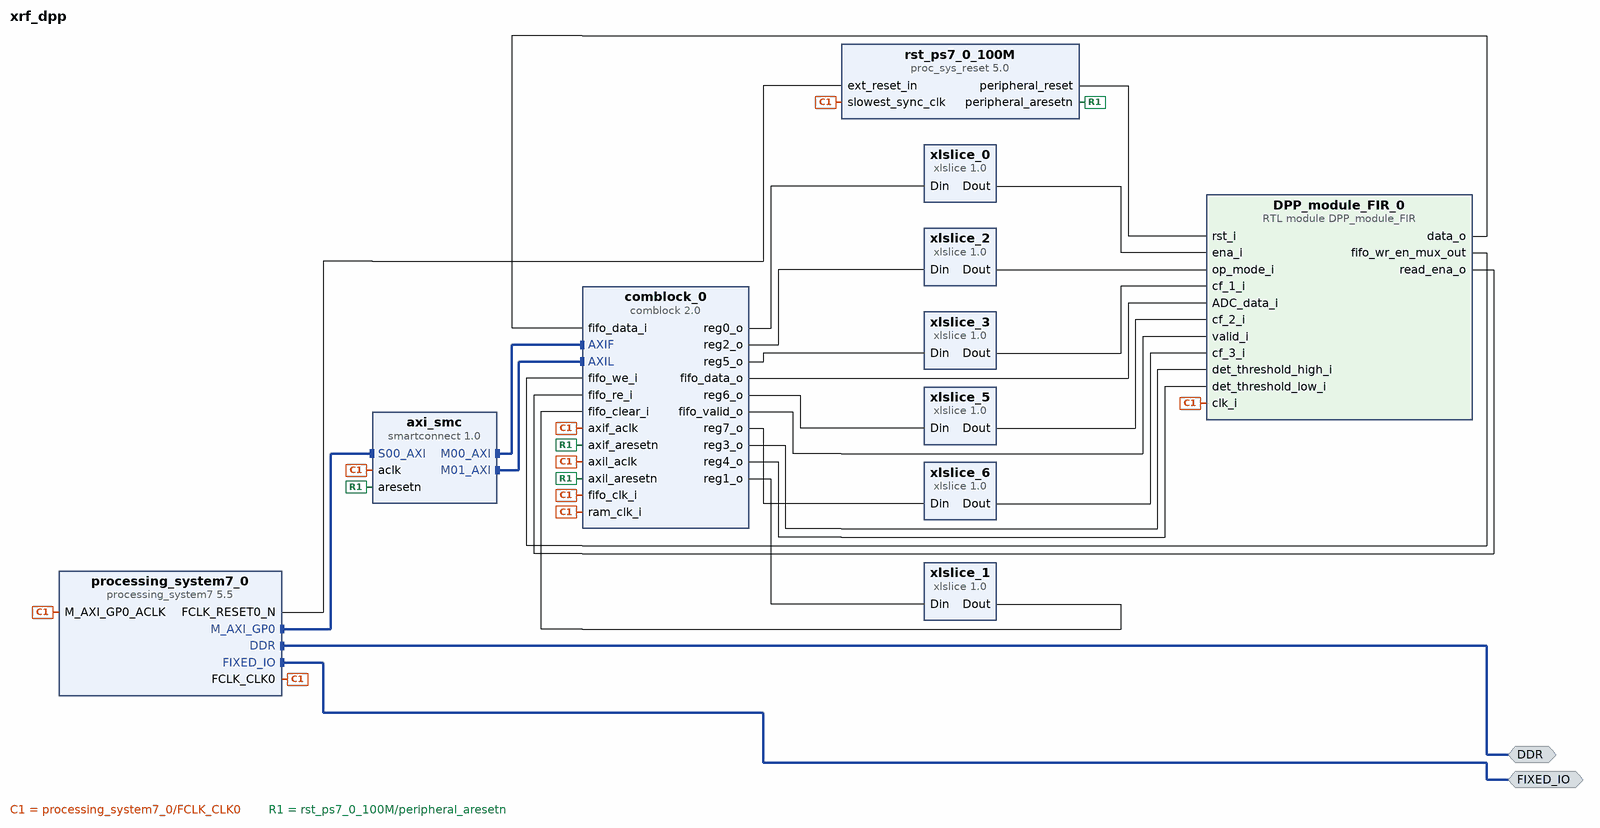
[diagram p0: block diagram of the top level]
# Vivado block design xrf_dpp, xc7z020clg484-1, Vivado 2022.2
create_bd_design xrf_dpp

create_bd_intf_port -mode Master -vlnv xilinx.com:interface:ddrx_rtl:1.0 DDR
create_bd_intf_port -mode Master -vlnv xilinx.com:display_processing_system7:fixedio_rtl:1.0 FIXED_IO

create_bd_cell -type module -reference DPP_module_FIR DPP_module_FIR_0
create_bd_cell -type ip -vlnv xilinx.com:ip:smartconnect:1.0 axi_smc
set_property -dict {CONFIG.NUM_MI 2 CONFIG.NUM_SI 1} [get_bd_cells axi_smc]
create_bd_cell -type ip -vlnv www.ictp.it:user:comblock:2.0 comblock_0
set_property -dict [list \
  CONFIG.FIFO_IN_DEPTH 8192 \
  CONFIG.FIFO_OUT_DEPTH 8192 \
  CONFIG.FIFO_OUT_ENA true \
  CONFIG.REGS_OUT_DEPTH 8 \
  CONFIG.REGS_OUT_DWIDTH 16 \
] [get_bd_cells comblock_0]
create_bd_cell -type ip -vlnv xilinx.com:ip:processing_system7:5.5 processing_system7_0
set_property -dict [list \
  CONFIG.PCW_APU_PERIPHERAL_FREQMHZ 666.666667 \
  CONFIG.PCW_ENET0_ENET0_IO {MIO 16 .. 27} \
  CONFIG.PCW_ENET0_GRP_MDIO_ENABLE 1 \
  CONFIG.PCW_ENET0_GRP_MDIO_IO {MIO 52 .. 53} \
  CONFIG.PCW_ENET0_PERIPHERAL_ENABLE 1 \
  CONFIG.PCW_ENET0_RESET_ENABLE 0 \
  CONFIG.PCW_ENET_RESET_ENABLE 1 \
  CONFIG.PCW_ENET_RESET_SELECT {Share reset pin} \
  CONFIG.PCW_FPGA0_PERIPHERAL_FREQMHZ 100.000000 \
  CONFIG.PCW_FPGA1_PERIPHERAL_FREQMHZ 150.000000 \
  CONFIG.PCW_FPGA2_PERIPHERAL_FREQMHZ 50.000000 \
  CONFIG.PCW_GPIO_MIO_GPIO_ENABLE 1 \
  CONFIG.PCW_GPIO_MIO_GPIO_IO MIO \
  CONFIG.PCW_I2C_RESET_ENABLE 1 \
  CONFIG.PCW_PRESET_BANK1_VOLTAGE {LVCMOS 1.8V} \
  CONFIG.PCW_QSPI_GRP_SINGLE_SS_ENABLE 1 \
  CONFIG.PCW_QSPI_GRP_SINGLE_SS_IO {MIO 1 .. 6} \
  CONFIG.PCW_QSPI_PERIPHERAL_ENABLE 1 \
  CONFIG.PCW_QSPI_PERIPHERAL_FREQMHZ 200.000000 \
  CONFIG.PCW_QSPI_QSPI_IO {MIO 1 .. 6} \
  CONFIG.PCW_SD0_GRP_CD_ENABLE 1 \
  CONFIG.PCW_SD0_GRP_CD_IO {MIO 47} \
  CONFIG.PCW_SD0_GRP_WP_ENABLE 1 \
  CONFIG.PCW_SD0_GRP_WP_IO {MIO 46} \
  CONFIG.PCW_SD0_PERIPHERAL_ENABLE 1 \
  CONFIG.PCW_SD0_SD0_IO {MIO 40 .. 45} \
  CONFIG.PCW_SDIO_PERIPHERAL_FREQMHZ 50 \
  CONFIG.PCW_SINGLE_QSPI_DATA_MODE x4 \
  CONFIG.PCW_TTC0_PERIPHERAL_ENABLE 1 \
  CONFIG.PCW_TTC0_TTC0_IO EMIO \
  CONFIG.PCW_UART1_PERIPHERAL_ENABLE 1 \
  CONFIG.PCW_UART1_UART1_IO {MIO 48 .. 49} \
  CONFIG.PCW_UART_PERIPHERAL_FREQMHZ 50 \
  CONFIG.PCW_UIPARAM_DDR_FREQ_MHZ 533.333313 \
  CONFIG.PCW_UIPARAM_DDR_PARTNO {MT41J128M16 HA-15E} \
  CONFIG.PCW_USB0_PERIPHERAL_ENABLE 1 \
  CONFIG.PCW_USB0_RESET_ENABLE 0 \
  CONFIG.PCW_USB0_USB0_IO {MIO 28 .. 39} \
  CONFIG.PCW_USB_RESET_ENABLE 1 \
  CONFIG.PCW_USB_RESET_SELECT {Share reset pin} \
  CONFIG.preset ZedBoard \
] [get_bd_cells processing_system7_0]
# 221 more settings of processing_system7_0 are not shown: defaults, MIO pin electricals, DDR timing, and values the tool derives
create_bd_cell -type ip -vlnv xilinx.com:ip:proc_sys_reset:5.0 rst_ps7_0_100M
create_bd_cell -type ip -vlnv xilinx.com:ip:xlslice:1.0 xlslice_0
set_property -dict {CONFIG.DIN_WIDTH 16} [get_bd_cells xlslice_0]
create_bd_cell -type ip -vlnv xilinx.com:ip:xlslice:1.0 xlslice_1
set_property -dict {CONFIG.DIN_WIDTH 16} [get_bd_cells xlslice_1]
create_bd_cell -type ip -vlnv xilinx.com:ip:xlslice:1.0 xlslice_2
set_property -dict {CONFIG.DIN_FROM 1 CONFIG.DIN_WIDTH 16} [get_bd_cells xlslice_2]
create_bd_cell -type ip -vlnv xilinx.com:ip:xlslice:1.0 xlslice_3
set_property -dict {CONFIG.DIN_FROM 4 CONFIG.DIN_WIDTH 16} [get_bd_cells xlslice_3]
create_bd_cell -type ip -vlnv xilinx.com:ip:xlslice:1.0 xlslice_5
set_property -dict {CONFIG.DIN_FROM 4 CONFIG.DIN_WIDTH 16} [get_bd_cells xlslice_5]
create_bd_cell -type ip -vlnv xilinx.com:ip:xlslice:1.0 xlslice_6
set_property -dict {CONFIG.DIN_FROM 4 CONFIG.DIN_WIDTH 16} [get_bd_cells xlslice_6]

# ---- connections ----

connect_bd_intf_net [get_bd_intf_pins axi_smc/M00_AXI] [get_bd_intf_pins comblock_0/AXIF]
connect_bd_intf_net [get_bd_intf_pins axi_smc/M01_AXI] [get_bd_intf_pins comblock_0/AXIL]
connect_bd_intf_net [get_bd_intf_ports DDR] [get_bd_intf_pins processing_system7_0/DDR]
connect_bd_intf_net [get_bd_intf_ports FIXED_IO] [get_bd_intf_pins processing_system7_0/FIXED_IO]
connect_bd_intf_net [get_bd_intf_pins axi_smc/S00_AXI] [get_bd_intf_pins processing_system7_0/M_AXI_GP0]
connect_bd_net [get_bd_pins DPP_module_FIR_0/data_o] [get_bd_pins comblock_0/fifo_data_i]
connect_bd_net [get_bd_pins DPP_module_FIR_0/fifo_wr_en_mux_out] [get_bd_pins comblock_0/fifo_we_i]
connect_bd_net [get_bd_pins DPP_module_FIR_0/read_ena_o] [get_bd_pins comblock_0/fifo_re_i]
connect_bd_net [get_bd_pins comblock_0/fifo_data_o] [get_bd_pins DPP_module_FIR_0/ADC_data_i]
connect_bd_net [get_bd_pins comblock_0/fifo_valid_o] [get_bd_pins DPP_module_FIR_0/valid_i]
connect_bd_net [get_bd_pins comblock_0/reg0_o] [get_bd_pins xlslice_0/Din]
connect_bd_net [get_bd_pins comblock_0/reg1_o] [get_bd_pins xlslice_1/Din]
connect_bd_net [get_bd_pins comblock_0/reg2_o] [get_bd_pins xlslice_2/Din]
connect_bd_net [get_bd_pins comblock_0/reg3_o] [get_bd_pins DPP_module_FIR_0/det_threshold_high_i]
connect_bd_net [get_bd_pins comblock_0/reg4_o] [get_bd_pins DPP_module_FIR_0/det_threshold_low_i]
connect_bd_net [get_bd_pins comblock_0/reg5_o] [get_bd_pins xlslice_3/Din]
connect_bd_net [get_bd_pins comblock_0/reg6_o] [get_bd_pins xlslice_5/Din]
connect_bd_net [get_bd_pins comblock_0/reg7_o] [get_bd_pins xlslice_6/Din]
connect_bd_net [get_bd_pins processing_system7_0/FCLK_CLK0] \
  [get_bd_pins DPP_module_FIR_0/clk_i] [get_bd_pins axi_smc/aclk] [get_bd_pins comblock_0/axif_aclk] \
  [get_bd_pins comblock_0/axil_aclk] [get_bd_pins comblock_0/fifo_clk_i] [get_bd_pins comblock_0/ram_clk_i] \
  [get_bd_pins processing_system7_0/M_AXI_GP0_ACLK] [get_bd_pins rst_ps7_0_100M/slowest_sync_clk]
connect_bd_net [get_bd_pins processing_system7_0/FCLK_RESET0_N] [get_bd_pins rst_ps7_0_100M/ext_reset_in]
connect_bd_net [get_bd_pins rst_ps7_0_100M/peripheral_aresetn] \
  [get_bd_pins axi_smc/aresetn] [get_bd_pins comblock_0/axif_aresetn] [get_bd_pins comblock_0/axil_aresetn]
connect_bd_net [get_bd_pins rst_ps7_0_100M/peripheral_reset] [get_bd_pins DPP_module_FIR_0/rst_i]
connect_bd_net [get_bd_pins xlslice_0/Dout] [get_bd_pins DPP_module_FIR_0/ena_i]
connect_bd_net [get_bd_pins xlslice_1/Dout] [get_bd_pins comblock_0/fifo_clear_i]
connect_bd_net [get_bd_pins xlslice_2/Dout] [get_bd_pins DPP_module_FIR_0/op_mode_i]
connect_bd_net [get_bd_pins xlslice_3/Dout] [get_bd_pins DPP_module_FIR_0/cf_1_i]
connect_bd_net [get_bd_pins xlslice_5/Dout] [get_bd_pins DPP_module_FIR_0/cf_2_i]
connect_bd_net [get_bd_pins xlslice_6/Dout] [get_bd_pins DPP_module_FIR_0/cf_3_i]

# ---- address map ----
assign_bd_address -offset 0x43C00000 -range 256K -target_address_space [get_bd_addr_spaces processing_system7_0/Data] [get_bd_addr_segs comblock_0/AXIF/AXIF]
assign_bd_address -offset 0x43C40000 -range 64K -target_address_space [get_bd_addr_spaces processing_system7_0/Data] [get_bd_addr_segs comblock_0/AXIL/AXIL]

validate_bd_design
save_bd_design
